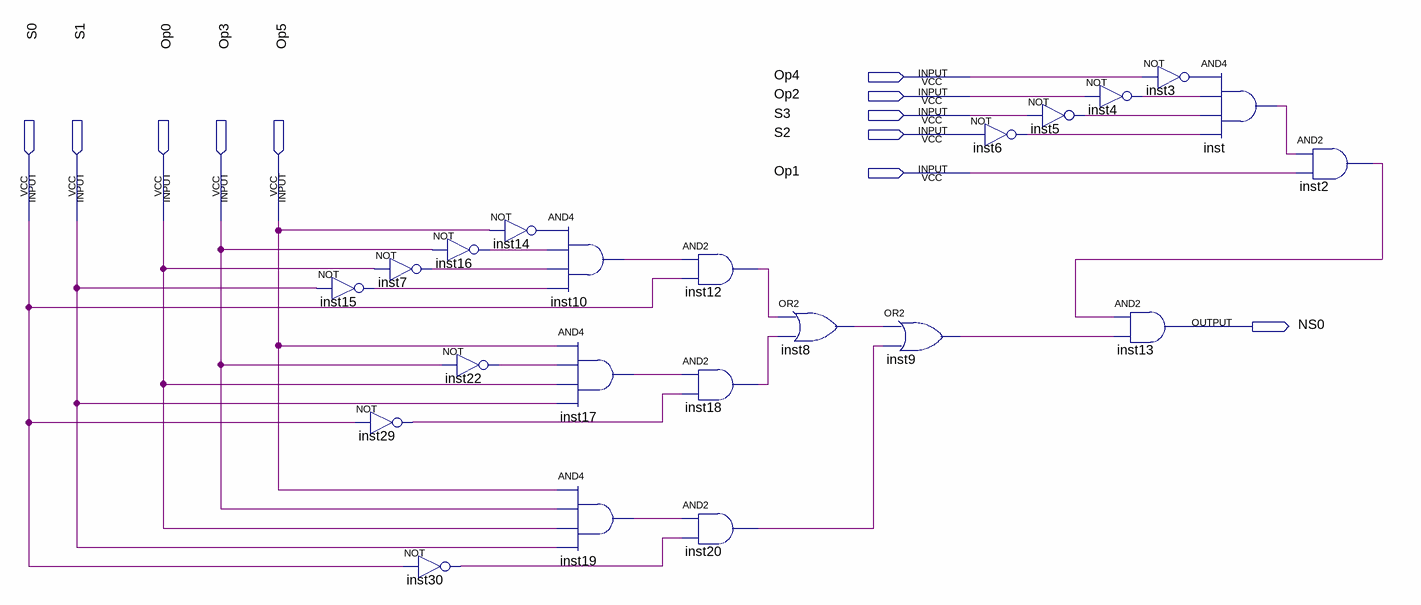
[diagram p0: schematic sheet]
// Quartus schematic NS0.bdf as structural Verilog: 22 symbols, 11 pins
module NS0 (
  input  Op4,
  input  Op2,
  input  S3,
  input  S2,
  input  Op1,
  input  S0,
  input  S1,
  input  Op0,
  input  Op3,
  input  Op5,
  output NS0
);

  wire inst2_out, inst3_out, inst4_out, inst5_out, inst6_out, inst7_out, inst8_out, inst9_out, inst10_out,
       inst12_out, inst14_out, inst15_out, inst16_out, inst17_out, inst18_out, inst19_out, inst20_out,
       inst22_out, inst29_out, inst30_out, inst_out;

  not inst15 (inst15_out, S1);
  not inst7 (inst7_out, Op0);
  not inst29 (inst29_out, S0);
  not inst30 (inst30_out, S0);
  not inst14 (inst14_out, Op5);
  not inst16 (inst16_out, Op3);
  not inst22 (inst22_out, Op3);
  and inst10 (inst10_out, inst14_out, inst16_out, inst7_out, inst15_out);
  and inst17 (inst17_out, Op5, inst22_out, Op0, S1);
  and inst19 (inst19_out, Op5, Op3, Op0, S1);
  and inst12 (inst12_out, inst10_out, S0);
  and inst18 (inst18_out, inst17_out, inst29_out);
  and inst20 (inst20_out, inst19_out, inst30_out);
  or inst8 (inst8_out, inst12_out, inst18_out);
  or inst9 (inst9_out, inst8_out, inst20_out);
  not inst5 (inst5_out, S3);
  not inst6 (inst6_out, S2);
  not inst4 (inst4_out, Op2);
  not inst3 (inst3_out, Op4);
  and inst13 (NS0, inst2_out, inst9_out);
  and inst (inst_out, inst3_out, inst4_out, inst5_out, inst6_out);
  and inst2 (inst2_out, inst_out, Op1);
endmodule
